# EAGLE design X7Segment (EAGLE 9.4.2)
DATE: LAST_DATE_TIME; REV: 2; TITLE: Neo7Segment
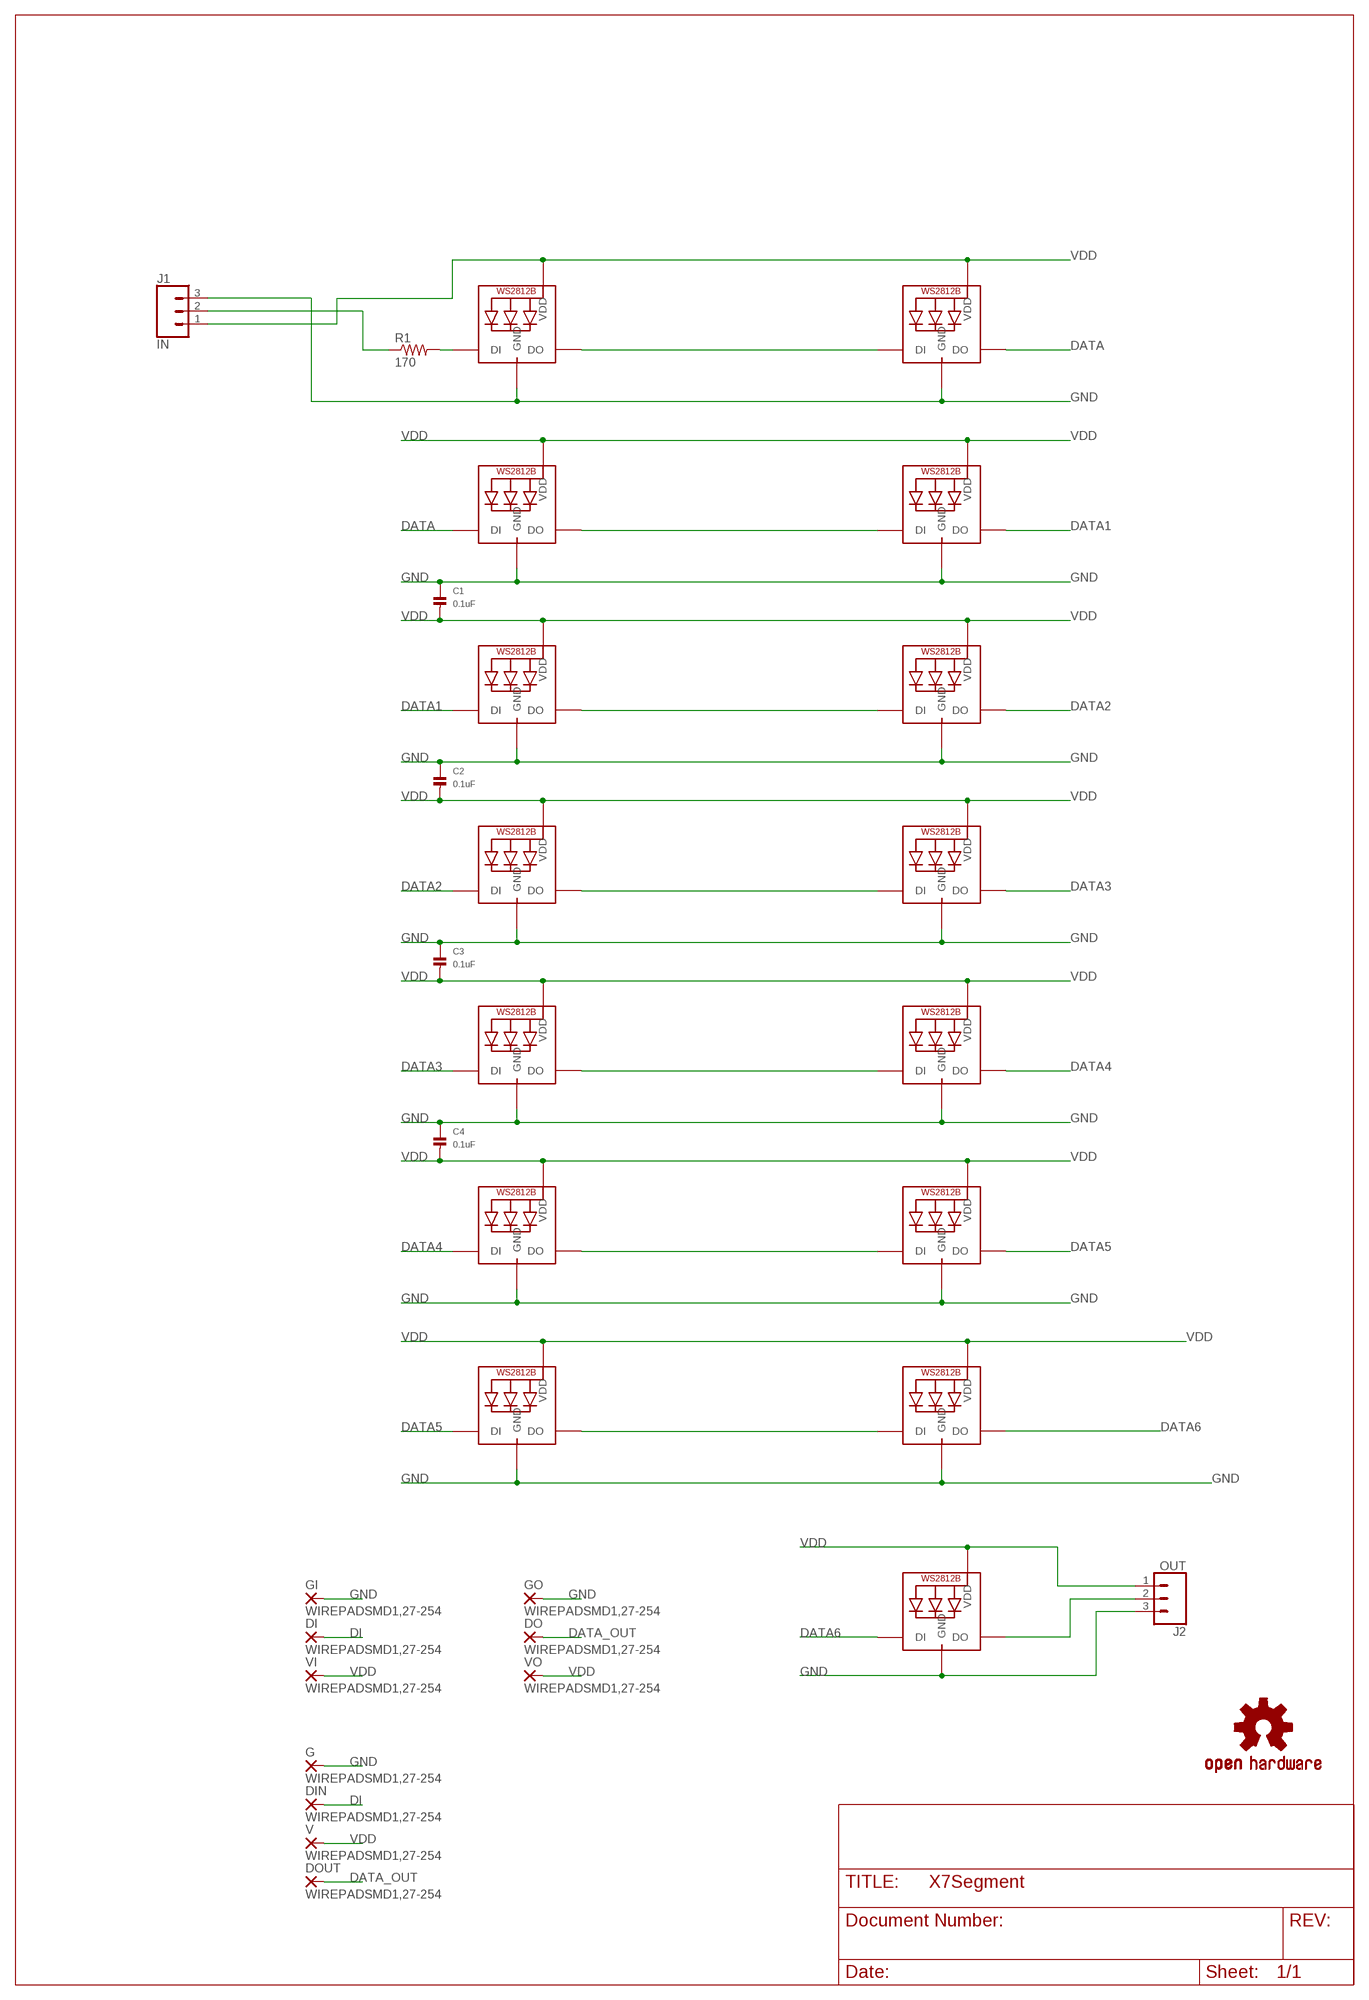
[diagram p0: schematic, sheet 1]

## Parts
C1  0.1uF  CAP_CERAMIC_0603MP  [_0603MP]
C2  0.1uF  CAP_CERAMIC_0603MP  [_0603MP]
C3  0.1uF  CAP_CERAMIC_0603MP  [_0603MP]
C4  0.1uF  CAP_CERAMIC_0603MP  [_0603MP]
DI  WIREPADSMD1,27-254  [SMD1,27-2,54]
DIN  WIREPADSMD1,27-254  [SMD1,27-2,54]
DO  WIREPADSMD1,27-254  [SMD1,27-2,54]
DOUT  WIREPADSMD1,27-254  [SMD1,27-2,54]
G  WIREPADSMD1,27-254  [SMD1,27-2,54]
GI  WIREPADSMD1,27-254  [SMD1,27-2,54]
GO  WIREPADSMD1,27-254  [SMD1,27-2,54]
J1  IN  CONN_031X03_NO_SILK  [1X03_NO_SILK]
J2  OUT  CONN_031X03_NO_SILK  [1X03_NO_SILK]
LED1  WS2812B4020_SIDEWAYS  [4020_SIDEWAYS]
LED4  WS2812B4020_SIDEWAYS  [4020_SIDEWAYS]
LED5  WS2812B4020_SIDEWAYS  [4020_SIDEWAYS]
LED8  WS2812B4020_SIDEWAYS  [4020_SIDEWAYS]
LED9  WS2812B4020_SIDEWAYS  [4020_SIDEWAYS]
LED12  WS2812B4020_SIDEWAYS  [4020_SIDEWAYS]
LED13  WS2812B4020_SIDEWAYS  [4020_SIDEWAYS]
LED16  WS2812B4020_SIDEWAYS  [4020_SIDEWAYS]
LED17  WS2812B4020_SIDEWAYS  [4020_SIDEWAYS]
LED20  WS2812B4020_SIDEWAYS  [4020_SIDEWAYS]
LED21  WS2812B4020_SIDEWAYS  [4020_SIDEWAYS]
LED24  WS2812B4020_SIDEWAYS  [4020_SIDEWAYS]
LED25  WS2812B4020_SIDEWAYS  [4020_SIDEWAYS]
LED28  WS2812B4020_SIDEWAYS  [4020_SIDEWAYS]
LED29  RGB 3535  WS2812B3535  [LED3535]
LOGO1  OSHW-LOGOS  [OSHW-LOGO-S]
R1  170  R-US_R0805  [R0805]
V  WIREPADSMD1,27-254  [SMD1,27-2,54]
VI  WIREPADSMD1,27-254  [SMD1,27-2,54]
VO  WIREPADSMD1,27-254  [SMD1,27-2,54]

## Nets
DATA: LED4.2-DOUT(DO) LED5.4-DIN(DI)
DATA1: LED8.2-DOUT(DO) LED9.4-DIN(DI)
DATA2: LED12.2-DOUT(DO) LED13.4-DIN(DI)
DATA3: LED16.2-DOUT(DO) LED17.4-DIN(DI)
DATA4: LED20.2-DOUT(DO) LED21.4-DIN(DI)
DATA5: LED24.2-DOUT(DO) LED25.4-DIN(DI)
DATA6: LED28.2-DOUT(DO) LED29.1(DI)
DATA_OUT: DO.1(P) DOUT.1(P) J2.2 LED29.3(DO)
DI: DI.1(P) DIN.1(P) J1.2 R1.1
DI_R: LED1.4-DIN(DI) R1.2
GND: C1.1 C2.1 C3.1 C4.1 G.1(P) GI.1(P) GO.1(P) J1.3 J2.3 LED1.3-GND(GND) LED4.3-GND(GND) LED5.3-GND(GND) LED8.3-GND(GND) LED9.3-GND(GND) LED12.3-GND(GND) LED13.3-GND(GND) LED16.3-GND(GND) LED17.3-GND(GND) LED20.3-GND(GND) LED21.3-GND(GND) LED24.3-GND(GND) LED25.3-GND(GND) LED28.3-GND(GND) LED29.4(GND)
N$1: LED5.2-DOUT(DO) LED8.4-DIN(DI)
N$2: LED9.2-DOUT(DO) LED12.4-DIN(DI)
N$3: LED13.2-DOUT(DO) LED16.4-DIN(DI)
N$4: LED21.2-DOUT(DO) LED24.4-DIN(DI)
N$5: LED25.2-DOUT(DO) LED28.4-DIN(DI)
N$29: LED1.2-DOUT(DO) LED4.4-DIN(DI)
N$40: LED17.2-DOUT(DO) LED20.4-DIN(DI)
VDD: C1.2 C2.2 C3.2 C4.2 J1.1 J2.1 LED1.1-VDD(VDD) LED4.1-VDD(VDD) LED5.1-VDD(VDD) LED8.1-VDD(VDD) LED9.1-VDD(VDD) LED12.1-VDD(VDD) LED13.1-VDD(VDD) LED16.1-VDD(VDD) LED17.1-VDD(VDD) LED20.1-VDD(VDD) LED21.1-VDD(VDD) LED24.1-VDD(VDD) LED25.1-VDD(VDD) LED28.1-VDD(VDD) LED29.2(VDD) V.1(P) VI.1(P) VO.1(P)

## Library data of the parts
C1-C4 = microbuilder:CAP_CERAMIC: Ceramic Capacitors 0402 - 0402 Surface Mount Capacitors 16pF 50V 5% [Digikey: 445-4899-2-ND] 18pF 50V 5% [Digikey: 490-1281-2-ND] 22pF 50V 5% [Digikey: 490-1283-2-ND] 68pF 50V 5% [Digikey: 490-1289-2-ND] 0.1uF 10V 10% [Digikey: 490-1318-2-ND] 1.0uF 6.3V 10% [Digikey: 490-1320-2-ND] 0603 - 0603 Surface Mount Capacitors 16 pF 50V 5% [Digikey: 445-5051-2-ND] 22 pF 50V [Digikey: PCC220ACVTR-ND] 33 pF 50V 5% [Digikey: 490-1415-1-ND] 56pF 50V 5% [Digikey: 490-1421-1-ND] 220pF 50V 5% [Digikey: 445-1285-1-ND] 680 pF 50V 2200 pF 50V 5% C0G [Digikey: 445-1297-1-ND] 5600 pF 100V 5% X7R [Digikey: 478-3711-1-ND] 0.1 µF 25V 10% [Digikey: PCC2277TR-ND] 0.22 µF 16V 10% X7R [Digikey: 445-1318-1-ND] 1.0 µF 25V 10% [Digikey: 445-5146-2-ND] 0603 - RF Specific 3pF 250V +/-0.1pF RF [Digikey: 712-1347-1-ND] 18 pF 250V 5% [Digikey: 478-3505-1-ND or 712-1322-1-ND] 56 pF 250V 5% C0G RF [Digikey: 490-4867-1-ND] 68 pF 250V RF [Digikey: 490-4868-1-ND] 0805 - 0805 Surface Mount Capacitors 220 pF 250V 2% RF Ceramic Capacitor [Digikey: 712-1398-1-ND] 1000 pF 50V 2% NP0 Ceramic Capacitor [Digikey: 478-3760-1-ND] 0.1 µF 25V 10% Ceramic Capacitor [Digikey: PCC1828TR-ND] 1.0 µF 16V 10% Ceramic Capacitor[Digikey: 490-1691-2-ND] 10.0 µF 10V 10% Ceramic Capacitor[Digikey: 709-1228-1-ND] 10.0 uF 16V 10% Ceramic Capacitor [Digikey: 478-5165-2-ND] 47 uF 6.3V 20% Ceramic Capacitor [Digikey: 587-1779-1-ND or 399-5506-1-ND] 1206 - 1206 Surface Mount Capacitors 47uF 10V 20% Ceramic Capacitor [Digikey: 490-5528-1-ND or 399-5508-1-ND or 445-6010-1-ND] 100uF 6.3V -20%, +80% Y5V Ceramic Capacitor (Digikey: 490-4512-1-ND, Mouser: 81-GRM31CF50J107ZE1L)
DI DIN DO DOUT G GI GO V VI VO = wirepad:WIREPAD: Wire PAD connect wire on PCB
J1 J2 = SparkFun-Connectors:CONN_03: Multi connection point. Often used as Generic Header-pin footprint for 0.1 inch spaced/style header connections On any of the 0.1 inch spaced packages, you can populate with these: Break Away Headers - Straight <https://www.sparkfun.com/products/116> (PRT-00116) Break Away Male Headers - Right Angle <https://www.sparkfun.com/products/553> (PRT-00553) Female Headers <https://www.sparkfun.com/products/115> (PRT-00115) Break Away Headers - Machine Pin <https://www.sparkfun.com/products/117> (PRT-00117) Break Away Female Headers - Swiss Machine Pin <https://www.sparkfun.com/products/743> (PRT-00743) Stackable Header - 3 Pin (Female, 0.1") <https://www.sparkfun.com/products/13875> (PRT-13875) For SCREWTERMINALS and SPRING TERMINALS visit here: Screw Terimnals on SparkFun.com <https://www.sparkfun.com/search/results?term=Screw+Terminals> (5mm/3.5mm/2.54mm spacing) This device is also useful as a general connection point to wire up your design to another part of your project. Our various solder wires solder well into these plated through hole pads. Hook-Up Wire - Assortment (Stranded, 22 AWG) <https://www.sparkfun.com/products/11375> (PRT-11375) Hook-Up Wire - Assortment (Solid Core, 22 AWG) <https://www.sparkfun.com/products/11367> (PRT-11367) View the entire wire category on our website here <https://www.sparkfun.com/categories/141> Special notes: Molex polarized connector foot print use with SKU : PRT-08232 with associated crimp pins and housings.
LED1 LED4 LED5 LED8 LED9 LED12 LED13 LED16 LED17 LED20 LED21 LED24 LED25 LED28 = UnexpectedMaker:WS2812B
LED29 = adafruit:WS2812B
LOGO1 = SparkFun-Aesthetics:OSHW-LOGO: Open-Source Hardware (OSHW) Logo This logo indicates the piece of hardware it is found on incorporates a OSHW license and/or adheres to the definition of open source hardware found here: http://freedomdefined.org/OSHW
R1 = rcl:R-US_: RESISTOR, American symbol; SPICEPREFIX: R

## Net classes
0 default: width 0.203 mm, drill 0.254 mm, clearance 0.102 mm

## Board
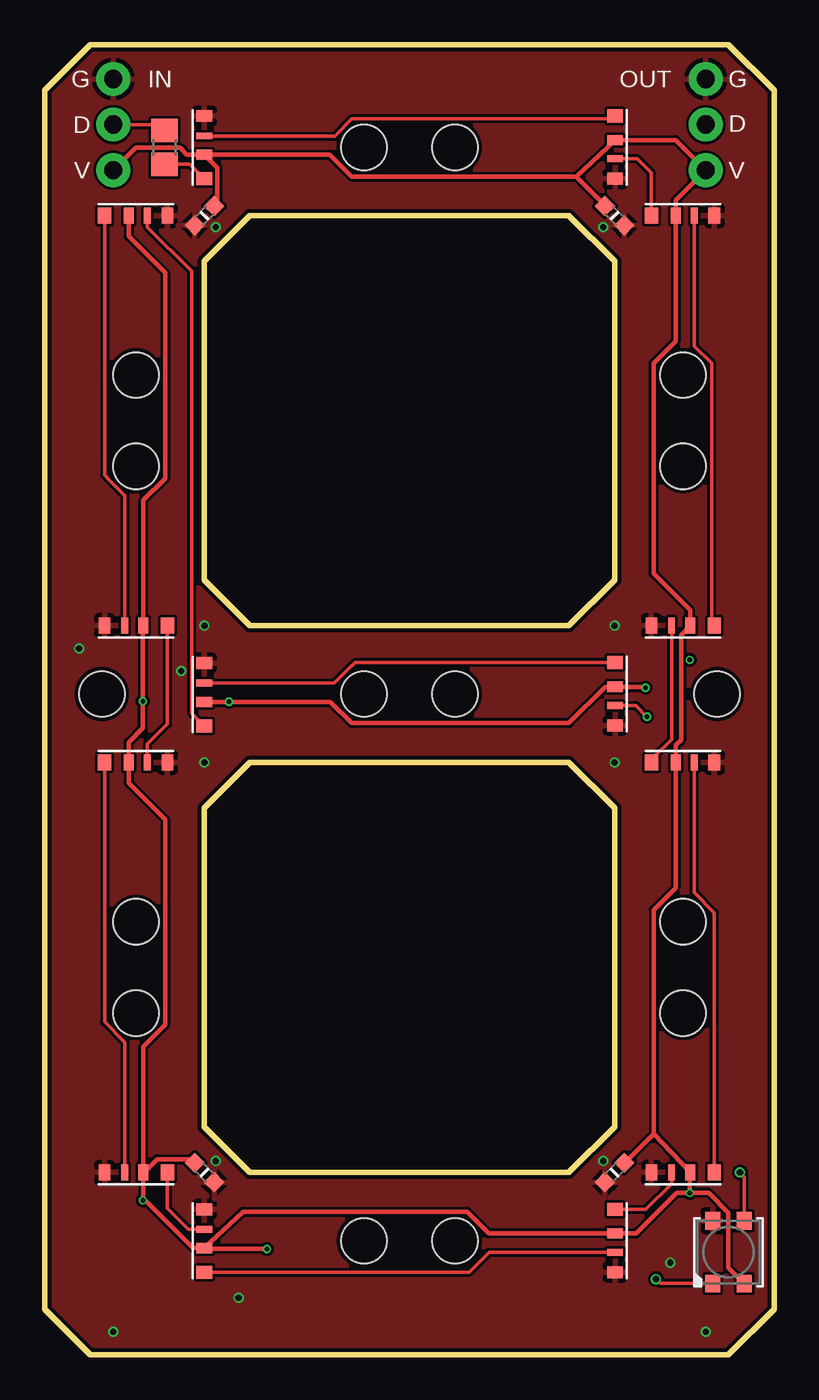
[diagram p1: board, top side]
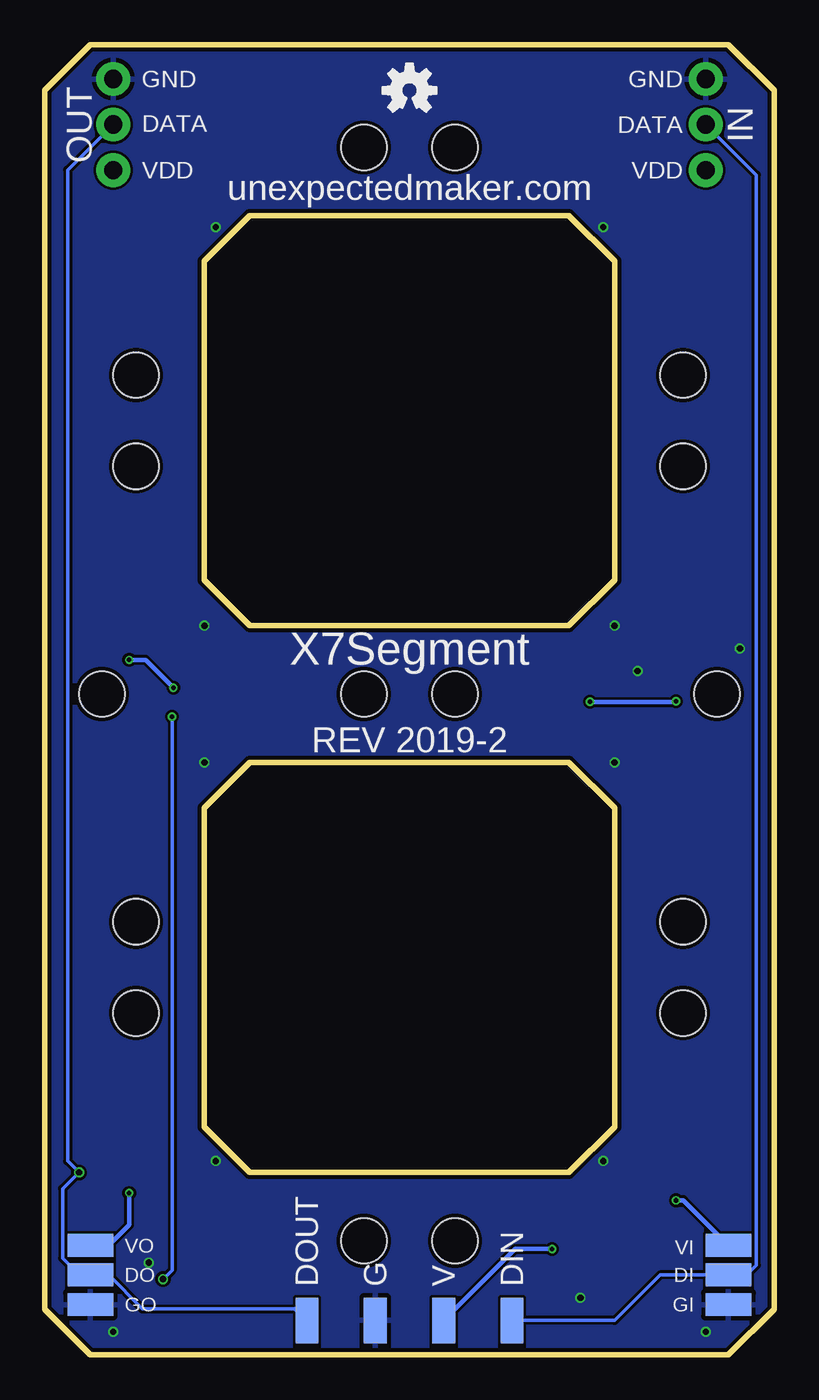
[diagram p2: board, bottom side, seen from below]

Size 40.64 x 73.03 mm. Coordinates in mm from the lower left corner, seen from the top.
Outline: 0,70.48 0,2.54 2.54,0 38.1,0 40.64,2.54 40.64,70.48 38.1,73.03 2.54,73.03 0,70.48
Outline: 11.43,40.64 29.21,40.64 31.75,43.18 31.75,60.96 29.21,63.5 11.43,63.5 8.89,60.96 8.89,43.18 11.43,40.64
Outline: 11.43,33.02 8.89,30.48 8.89,12.7 11.43,10.16 29.21,10.16 31.75,12.7 31.75,30.48 29.21,33.02 11.43,33.02
Copper layers (1*16): Top 0.035mm / dielectric 1.5mm / Bottom 0.035mm
Design rules "UnexpectedMaker_JLCPCB 2 Layer": minimum track width 6mil, minimum drill 10mil, track to track 6mil, track to pad 6mil, pad to pad 6mil, via to via 6mil, smd to smd 6mil, copper to edge 9mil, drill to drill 7mil, minimum pad ring 4mil, minimum via ring 4mil, stop-mask expansion 4mil, vias tented up to drill 25mil, thermal gap 10mil
Holes 2.54 mm at 3.17,36.83 37.47,36.83 17.78,67.31 22.86,67.31 17.78,36.83 22.86,36.83 17.78,6.35 22.86,6.35 5.08,54.61 5.08,49.53 35.56,49.53 35.56,54.61 5.08,24.13 5.08,19.05 35.56,19.05 35.56,24.13

### Footprints (pad centres in the part's own frame; a part is rotated, then mirrored left to right if it is on the bottom)
_0603MP = smd 0.8 x 0.8: 1 -0.762,0; 2 0.762,0
SMD1,27-2,54 = smd 1.27 x 2.54: 1 0,0
1X03_NO_SILK = drill 1.016 pad 1.88: 1 0,0; 2 2.54,0; 3 5.08,0
4020_SIDEWAYS = smd 0.889 x 0.559: 1-VDD 0,-0.406 | smd 0.889 x 0.381: 2-DOUT 0,0.635 | smd 0.889 x 0.66: 3-GND 0,1.753 | smd 0.889 x 0.737: 4-DIN 0,-1.753
LED3535 = smd 1 x 0.85: 1 -1.75,0.875; 2 -1.75,-0.875; 3 1.75,-0.875; 4 1.75,0.875
R0805 = smd 1.3 x 1.5: 1 -0.95,0; 2 0.95,0

### Placement (x,y rotation side)
C1  8.89,63.5 45 top
C2  8.89,10.16 135 top
C3  31.75,63.5 135 top
C4  31.75,10.16 45 top
DI  2.54,4.45 270 bottom
DIN  14.61,1.91 0 bottom
DO  38.1,4.45 270 bottom
DOUT  26.04,1.91 0 bottom
G  22.22,1.91 0 bottom
GI  2.54,2.79 270 bottom
GO  38.1,2.79 270 bottom
J1  3.81,66.04 90 top
J2  36.83,66.04 90 top
LED1  8.89,67.31 0 top
LED4  31.78,67.31 180 top
LED5  35.56,63.5 270 top
LED8  35.56,40.64 90 top
LED9  35.56,33.02 270 top
LED12  35.56,10.16 90 top
LED13  31.78,6.35 180 top
LED16  8.89,6.35 0 top
LED17  5.08,10.16 90 top
LED20  5.08,33.02 270 top
LED21  5.08,40.64 90 top
LED24  5.08,63.5 270 top
LED25  8.89,36.8 0 top
LED28  31.78,36.83 180 top
LED29  38.1,5.71 90 top
LOGO1  20.32,70.48 0 bottom
R1  6.67,67.31 270 top
V  18.41,1.91 0 bottom
VI  2.54,6.1 270 bottom
VO  38.1,6.1 270 bottom

### Tracks (layer width: path | path; a pad name or v marks a point on that pad's centre or on a via)
DATA
  Top 0.203: LED4.2-DOUT 33.02,66.68 33.81,65.89 LED5.4-DIN
DATA1
  Top 0.203: LED8.2-DOUT 34.93,34.29 33.97,33.34 LED9.4-DIN
DATA2
  Top 0.203: LED12.2-DOUT 34.93,9.52 33.5,8.1 LED13.4-DIN
DATA3
  Top 0.203: LED16.2-DOUT 8,6.98 6.83,8.15 LED17.4-DIN
DATA4
  Top 0.203: LED20.2-DOUT 5.72,34.04 6.83,35.15 LED21.4-DIN
DATA5
  Top 0.203: LED24.2-DOUT 5.72,62.87 8.19,60.39 8.19,35.75 LED25.4-DIN
DATA6  (via drill 0.25, 0.35)
  Top 0.203: LED29.1 34.3,3.96 v34.05,4.21 | LED28.2-DOUT 32.92,36.2 v33.55,35.56
  Bottom 0.203: v33.55,35.56 33.55,4.71 v34.05,4.21
DATA_OUT  (via drill 0.35)
  Top 0.203: LED29.3 38.98,9.92 v38.73,10.16
  Bottom 0.203: 26.69,2.56 35.2,2.56 37.09,4.45 DO.1 38.42,4.76 39.03,4.76 39.65,5.38 39.65,9.25 v38.73,10.16 39.37,10.8 39.37,66.04 J2.2
  Bottom 0.254: 26.69,2.56 DOUT.1
DI
  Top 0.203: J1.2 6.35,68.58 R1.1
  Bottom 0.203: J1.2 0.99,65.76 0.99,4.98 1.53,4.45 DI.1 6.35,4.45 8.89,1.91 DIN.1
DI_R
  Top 0.203: R1.2 8.09,66.36 LED1.4-DIN
GND  (via drill 0.35)
  other vias: 10.79,3.17 31.11,10.8 31.75,33.02 31.75,40.64 1.91,39.37 3.81,1.27 8.89,40.64 36.83,1.27 9.52,62.87 34.85,5.13 7.61,38.11 31.11,62.87 8.89,33.02 9.52,10.8
  pour Top: -0.63,73.66 -0.63,-0.63 41.28,-0.63 41.28,73.66
  pour Bottom: -1.27,74.29 41.91,74.29 41.91,-1.27 -1.27,-1.27
N$1
  Top 0.203: LED5.2-DOUT 36.2,56.24 37.16,55.27 37.16,40.78 LED8.4-DIN
N$2
  Top 0.203: LED9.2-DOUT 36.2,25.76 37.31,24.64 LED12.4-DIN
N$3
  Top 0.203: LED13.2-DOUT 24.76,5.71 23.65,4.6 LED16.4-DIN
N$4
  Top 0.203: LED21.2-DOUT 4.44,47.9 3.48,48.87 3.48,48.9 3.33,49.05 LED24.4-DIN
N$5
  Top 0.203: LED25.2-DOUT 16.13,37.44 17.12,38.43 17.14,38.43 17.3,38.58 LED28.4-DIN
N$29
  Top 0.203: LED1.2-DOUT 16.15,67.94 17.12,68.91 31.64,68.91 LED4.4-DIN
N$40
  Top 0.203: LED17.2-DOUT 4.44,17.42 3.33,18.54 LED20.4-DIN
VDD  (via drill 0.25)
  Top 0.254: J1.1 5.06,67.29 7.53,67.29 7.92,66.9 LED1.1-VDD | 29.62,65.68 17.11,65.68 15.89,66.9 LED1.1-VDD | 29.62,65.68 31.21,64.09 C3.2 | 33.93,12.32 33.93,24.8 35.15,26.02 LED9.1-VDD 35.15,33.98 35.46,34.28 35.46,40.13 LED8.1-VDD 35.97,41.5 33.93,43.54 33.93,55.28 35.15,56.5 LED5.1-VDD 35.15,64.36 J2.1 35.15,67.72 LED4.1-VDD 29.62,65.68 | 33.93,12.32 33.93,12.31 32.32,10.7 C4.2 | LED29.2 38.1,4.84 38.1,7.91 36.99,9.02 v35.94,9.02 | v12.37,5.89 9.09,5.89 LED16.1-VDD | v35.94,9.02 35.23,9.02 32.97,6.76 LED13.1-VDD 24.75,6.76 23.53,7.98 11.05,7.98 LED16.1-VDD | v35.94,9.02 35.94,10.26 LED12.1-VDD 33.93,12.32 | C2.2 8.16,10.89 6.26,10.89 5.66,10.29 LED17.1-VDD | LED17.1-VDD 5.49,17.16 6.71,18.38 6.71,29.84 4.67,31.88 LED20.1-VDD 4.67,34.14 5.46,34.93 v5.46,36.42 5.46,36.83 5.46,40.74 LED21.1-VDD 5.49,47.64 6.71,48.86 6.71,60.32 4.67,62.36 LED24.1-VDD | LED25.1-VDD v10.26,36.4 15.91,36.4 17.11,35.2 29.21,35.2 31.24,37.24 LED28.1-VDD 33.43,37.24 v33.48,37.19 | C1.2 9.61,64.22 9.61,66.18 LED1.1-VDD | LED17.1-VDD 5.49,8.63 v5.46,8.61 5.59,8.61 8.25,5.94 LED16.1-VDD
  Bottom 0.254: V.1 14.43,5.89 v12.37,5.89 | VI.1 5.05,8.61 v5.46,8.61 | v5.46,36.42 | v33.48,37.19 35.03,38.73 v35.94,38.73 | VO.1 37.08,6.1 35.94,7.24 v35.94,9.02 | v10.26,36.4 5.49,36.4 v5.46,36.42

### Text on the board
tPlace: G | G | D | D | V | V
bPlace: GND | GND | IN | DATA | DATA | OUT | VDD | VDD | unexpectedmaker.com | X7Segment | REV 2019-2